# EAGLE design buttons-DIP (EAGLE 7.3.0)
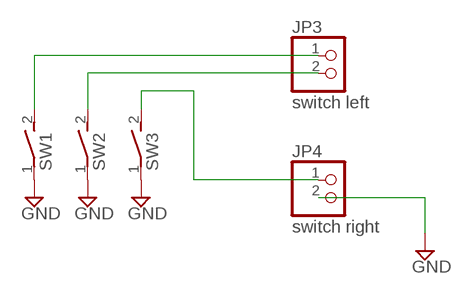
[diagram p0: schematic, sheet 1]

## Parts
JP3  switch left  PINHD-1X2  [1X02]
JP4  switch right  PINHD-1X2  [1X02]
SW1  TVBP060.3INCH-PITCH  [TVBP06-0.3INCH]
SW2  TVBP060.3INCH-PITCH  [TVBP06-0.3INCH]
SW3  TVBP060.3INCH-PITCH  [TVBP06-0.3INCH]

## Nets
GND [power]: JP4.2 SW1.1 SW2.1 SW3.1
N$1: JP3.1 SW1.2
N$2: JP3.2 SW2.2
N$3: JP4.1 SW3.2

## Library data of the parts
JP3 JP4 = pinhead:PINHD-1X2: PIN HEADER
SW1-SW3 = switch-custom:TVBP06

## Net classes
2 power: width 0.61 mm, drill 0.305 mm, clearance 0.254 mm

## Board
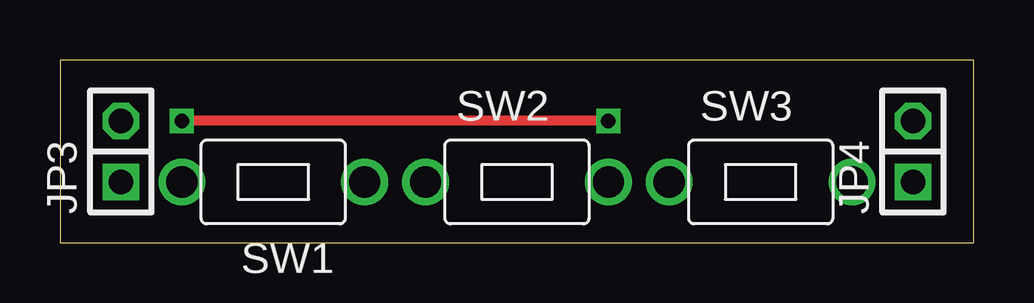
[diagram p1: board, top side]
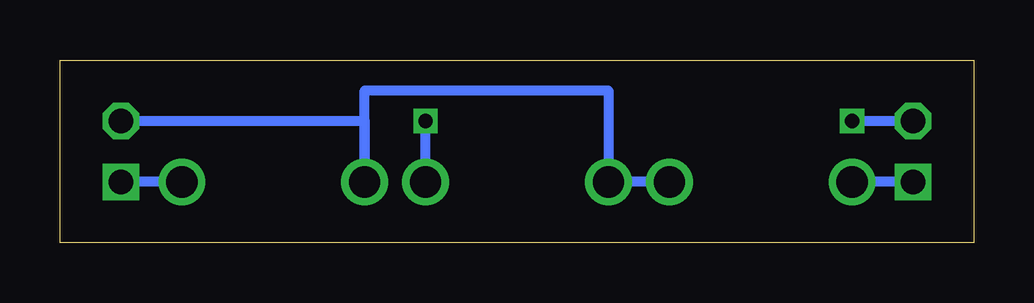
[diagram p2: board, bottom side, seen from below]

Size 38.1 x 7.62 mm. Coordinates in mm from the lower left corner, seen from the top.
Outline: 0,0 38.1,0 38.1,7.62 0,7.62 0,0
Copper layers (1*16): Top 0.035mm / dielectric 1.5mm / Bottom 0.035mm
Design rules "default": minimum track width 10mil, minimum drill 24mil, track to track 8mil, track to pad 8mil, pad to pad 8mil, via to via 8mil, smd to smd 8mil, copper to edge 40mil, drill to drill 8mil, minimum pad ring 10mil, minimum via ring 8mil, stop-mask expansion 4mil, vias tented up to drill 0mil, thermal gap 10mil

### Footprints (pad centres in the part's own frame; a part is rotated, then mirrored left to right if it is on the bottom)
1X02 = drill 1.016 square: 1 -1.27,0 | drill 1.016 octagon: 2 1.27,0
TVBP06-0.3INCH = drill 1.3: 1 -5.08,0; 2 2.54,0

### Placement (x,y rotation side)
JP3  2.54,3.81 90 top
JP4  35.56,3.81 90 top
SW1  7.62,2.54 180 top
SW2  20.32,2.54 0 top
SW3  30.48,2.54 0 top

### Tracks (layer width: path | path; a pad name or v marks a point on that pad's centre or on a via)
GND
  Bottom 0.406: SW1.1 SW2.1 15.24,6.35 25.4,6.35 SW3.1 25.4,5.08 JP4.2
N$1
  Bottom 0.406: JP3.1 SW1.2
N$2  (via drill 0.6)
  Top 0.406: v22.86,5.08 v5.08,5.08
  Bottom 0.406: SW2.2 v22.86,5.08 | v5.08,5.08 JP3.2
N$3
  Bottom 0.406: SW3.2 JP4.1

### Text on the board
tDocu: 片面ユニバーサル基板はだめ。